# EAGLE design Schematic_vcc_gnd 11-10 (EAGLE 9.6.2)
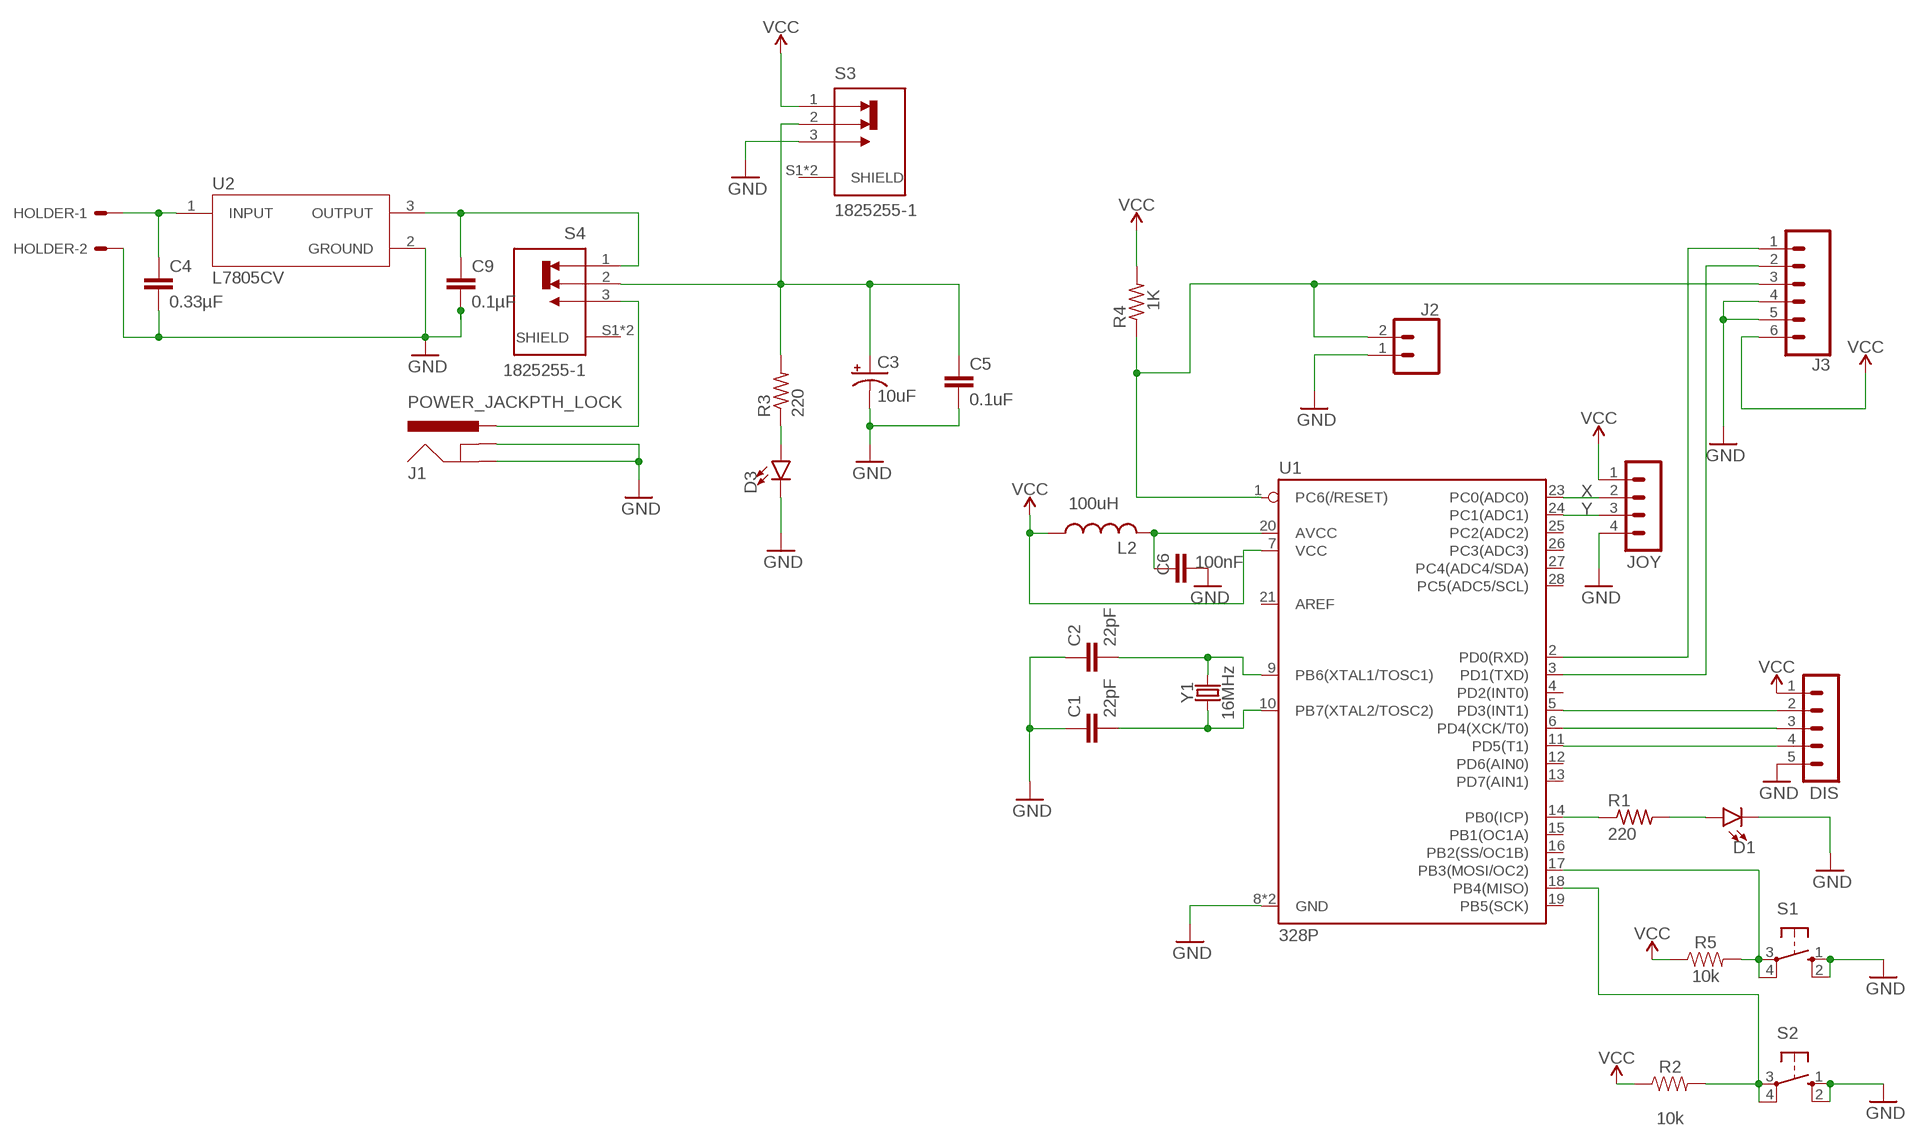
[diagram p0: schematic, sheet 1]

## Parts
C1  22pF  22PF-PTH-2.54MM-200V-5%  [CAP-PTH-2.54]
C2  22pF  22PF-PTH-2.54MM-200V-5%  [CAP-PTH-2.54]
C3  10uF  10UF-POLAR-RADIAL-2.5MM-25V-20%  [CPOL-RADIAL-2.5MM-5MM]
C4  0.33µF  C2.5/2  [C2.5-2]
C5  0.1uF  0.1UF-KIT-EZ-50V-20%  [CAP-PTH-SMALL-KIT]
C6  C2,5-3  [C2.5-3]
C9  0.1µF  C2.5/2  [C2.5-2]
D1  LED3MM  [LED_3MM]
D3  LED3MM  [LED_3MM]
DIS  MA05-1  [MA05-1]
HOLDER  22-23-2021  [22-23-2021]
J1  POWER_JACKPTH_LOCK  [POWER_JACK_PTH_LOCK]
J2  CONN_02  [1X02]
J3  CONN_06SILK_FEMALE_PTH  [1X06]
JOY  MA04-1  [MA04-1]
L2  L-US0204/5  [0204/5]
R1  220  R-US_0207/10  [0207/10]
R2  10k  10KOHM-HORIZ-1/4W-1%  [AXIAL-0.3]
R3  220  R-US_0207/10  [0207/10]
R4  1K  R-US_0207/10  [0207/10]
R5  10k  10KOHM-HORIZ-1/4W-1%  [AXIAL-0.3]
S1  40-XX  [B3F-40XX]
S2  40-XX  [B3F-40XX]
S3  1825255-1  [SW_1825255-1]
S4  1825255-1  [SW_1825255-1]
U1  328P  ATMEGA328P_PDIP  [DIP28]
U2  L7805CV  [TO255P1040X460X1968-3]
Y1  16MHz  CRYSTAL-16MHZPTH-HC49US  [HC49US]

## Nets
GND: C1.1 C2.1 C3.2(-) C4.2 C5.2 C6.2 C9.2 D1.K(C) D3.K(C) DIS.5 HOLDER.2 J1.GND J1.GNDBREAK J2.1 J3.4 J3.5 JOY.4 S1.1(S) S1.2(S1) S2.1(S) S2.2(S1) S3.3 U1.8(GND) U1.22(GND) U2.2(GROUND)
N$1: J2.2 J3.3 R4.1 U1.1(PC6(/RESET))
N$2: D3.A R3.1
N$3: C2.2 U1.9(PB6(XTAL1/TOSC1)) Y1.2
N$4: C1.2 U1.10(PB7(XTAL2/TOSC2)) Y1.1
N$5: R1.1 U1.14(PB0(ICP))
N$6: D1.A R1.2
N$7: DIS.2 U1.5(PD3(INT1))
N$8: DIS.3 U1.6(PD4(XCK/T0))
N$9: J3.1 U1.2(PD0(RXD))
N$10: J3.2 U1.3(PD1(TXD))
N$11: C6.1 L2.2 U1.20(AVCC)
N$12: DIS.4 U1.11(PD5(T1))
N$13: R2.P$2 S2.3(P) S2.4(P1) U1.18(PB4(MISO))
N$14: R5.P$2 S1.3(P) S1.4(P1) U1.17(PB3(MOSI/OC2))
N$15: J1.PWR S4.3
N$16: C4.1 HOLDER.1 U2.1(INPUT)
N$17: C9.1 S4.1 U2.3(OUTPUT)
N$19: C3.1(+) C5.1 R3.2 S3.2 S4.2
VCC: DIS.1 J3.6 JOY.1 L2.1 R2.P$1 R4.2 R5.P$1 S3.1 U1.7(VCC)
X: JOY.2 U1.23(PC0(ADC0))
Y: JOY.3 U1.24(PC1(ADC1))
Unconnected: S3.S1(SHIELD) S3.S2(SHIELD) S4.S1(SHIELD) S4.S2(SHIELD) U1.4(PD2(INT0)) U1.12(PD6(AIN0)) U1.13(PD7(AIN1)) U1.15(PB1(OC1A)) U1.16(PB2(SS/OC1B)) U1.19(PB5(SCK)) U1.21(AREF) U1.25(PC2(ADC2)) U1.26(PC3(ADC3)) U1.27(PC4(ADC4/SDA)) U1.28(PC5(ADC5/SCL))

## Library data of the parts
C1 C2 = SparkFun-Capacitors:22PF: 22pF ceramic capacitors A capacitor is a passive two-terminal electrical component used to store electrical energy temporarily in an electric field.; PROD_ID: CAP-09128
C3 = SparkFun-Capacitors:10UF-POLAR: 10.0µF polarized capacitors A capacitor is a passive two-terminal electrical component used to store electrical energy temporarily in an electric field.; PROD_ID: CAP-08440
C4 C6 C9 = capacitor-wima:C: CAPACITOR naming: grid - package width
C5 = SparkFun-Capacitors:0.1UF: 0.1µF ceramic capacitors A capacitor is a passive two-terminal electrical component used to store electrical energy temporarily in an electric field.; PROD_ID: CAP-08370
D1 D3 = SparkFun-LED:LED: LED (Generic) Standard schematic elements and footprints for 5mm, 3mm, 1206, and 0603 sized LEDs. Generic LEDs with no color specified.; PROD_ID: DIO-08794
DIS = con-lstb:MA05-1: PIN HEADER; OC_FARNELL: unknown; OC_NEWARK: unknown
HOLDER = con-molex:22-23-2021: .100" (2.54mm) Center Header - 2 Pin; MF: MOLEX; MPN: Holder; OC_FARNELL: 1462926; OC_NEWARK: 25C3832
J1 = SparkFun-Connectors:POWER_JACK: Power Jack Connector This is the standard 5.5mm barrel jack for power. The PTH is the most common, proven, reliable, footprint. The Slot footprint only works if the mill layer is transmitted to the PCB fab house so be warned. Here are the connectors we sell at SparkFun: DC Barrel Power Jack/Connector <https://www.sparkfun.com/products/119> (PRT-00119) DC Barrel Power Jack/Connector (SMD) <https://www.sparkfun.com/products/12748> (PRT-12748) DC Barrel Jack Adapter - Breadboard Compatible <https://www.sparkfun.com/products/10811> (PRT-10811) It is used on this SparkFun product (and many, many others): SparkFun RedBoard - Programmed with Arduino <https://www.sparkfun.com/products/12757> (DEV-12757) Also, if you need a mating power supply or connector, please check these out: Wall Adapter Power Supply - 9VDC 650mA <https://www.sparkfun.com/products/298> (TOL-00298) DC Barrel Jack Adapter - Male <https://www.sparkfun.com/products/10287> (PRT-10287); PROD_ID: CONN-08197; SF_ID: PRT-00119
J2 = SparkFun-Connectors:CONN_02: Multi connection point. Often used as Generic Header-pin footprint for 0.1 inch spaced/style header connections On any of the 0.1 inch spaced packages, you can populate with these: Break Away Headers - Straight <https://www.sparkfun.com/products/116> (PRT-00116) Break Away Male Headers - Right Angle <https://www.sparkfun.com/products/553> (PRT-00553) Female Headers <https://www.sparkfun.com/products/115> (PRT-00115) Break Away Headers - Machine Pin <https://www.sparkfun.com/products/117> (PRT-00117) Break Away Female Headers - Swiss Machine Pin <https://www.sparkfun.com/products/743> (PRT-00743) For SCREWTERMINALS and SPRING TERMINALS visit here: Screw Terimnals on SparkFun.com <https://www.sparkfun.com/search/results?term=Screw+Terminals> (5mm/3.5mm/2.54mm spacing) This device is also useful as a general connection point to wire up your design to another part of your project. Our various solder wires solder well into these plated through hole pads. Hook-Up Wire - Assortment (Stranded, 22 AWG) <https://www.sparkfun.com/products/11375> (PRT-11375) Hook-Up Wire - Assortment (Solid Core, 22 AWG) <https://www.sparkfun.com/products/11367> (PRT-11367) View the entire wire category on our website here <https://www.sparkfun.com/categories/141> Special notes: Molex polarized connector foot print use with: PRT-08233 with associated crimp pins and housings. 2.54_SCREWTERM for use with PRT-10571. 3.5mm Screw Terminal footprints for PRT-08084 5mm Screw Terminal footprints for use with PRT-08432
J3 = SparkFun-Connectors:CONN_06: Multi connection point. Often used as Generic Header-pin footprint for 0.1 inch spaced/style header connections On any of the 0.1 inch spaced packages, you can populate with these: Break Away Headers - Straight <https://www.sparkfun.com/products/116> (PRT-00116) Break Away Male Headers - Right Angle <https://www.sparkfun.com/products/553> (PRT-00553) Female Headers <https://www.sparkfun.com/products/115> (PRT-00115) Break Away Headers - Machine Pin <https://www.sparkfun.com/products/117> (PRT-00117) Break Away Female Headers - Swiss Machine Pin <https://www.sparkfun.com/products/743> (PRT-00743) Arduino Stackable Header - 6 Pin <https://www.sparkfun.com/products/9280> (PRT-09280) For SCREWTERMINALS and SPRING TERMINALS visit here: Screw Terimnals on SparkFun.com <https://www.sparkfun.com/search/results?term=Screw+Terminals> (5mm/3.5mm/2.54mm spacing) This device is also useful as a general connection point to wire up your design to another part of your project. Our various solder wires solder well into these plated through hole pads. Hook-Up Wire - Assortment (Stranded, 22 AWG) <https://www.sparkfun.com/products/11375> (PRT-11375) Hook-Up Wire - Assortment (Solid Core, 22 AWG) <https://www.sparkfun.com/products/11367> (PRT-11367) View the entire wire category on our website here <https://www.sparkfun.com/categories/141>; PROD_ID: CONN-08437
JOY = con-lstb:MA04-1: PIN HEADER; OC_FARNELL: unknown; OC_NEWARK: unknown
L2 = rcl:L-US: INDUCTOR, American symbol; SPICEPREFIX: L
R1 R3 R4 = rcl:R-US_: RESISTOR, American symbol; SPICEPREFIX: R
R2 R5 = SparkFun-Resistors:10KOHM: 10kΩ resistor A resistor is a passive two-terminal electrical component that implements electrical resistance as a circuit element. Resistors act to reduce current flow, and, at the same time, act to lower voltage levels within circuits. - Wikipedia; PROD_ID: RES-12183
S1 S2 = switch-omron:40-XX: OMRON SWITCH; MF: OMRON COMPONENTS USA; MPN: B3F-4000; OC_FARNELL: 176434; OC_NEWARK: 36K3105
S3 S4 = 1825255-1:1825255-1: Switch Slide ON None ON SPDT Top Slide 0.3A 125VAC PC Pins Thru-Hole Tray; MANUFACTURER: TE Connectivity; MAXIMUM_PACKAGE_HEIGHT: 12 mm; PARTREV: B2; STANDARD: Manufacturer Recommendations
U1 = SparkFun-IC-Microcontroller:ATMEGA328P_PDIP: Atmel 328P Through hole ATMEGA328P uC used in the Arduino 32kb flash, 1k EEPROM, 2k SRAM Datasheet <http://www.sparkfun.com/datasheets/Components/SMD/ATMega328.pdf> SparkFun Products Storefront component: AVR 28 Pin 20MHz 32K 6A/D - ATMega328P <https://www.sparkfun.com/products/9061> (COM-09061) SparkFun Simon Says - Through-Hole Soldering Kit <https://www.sparkfun.com/products/10547> (KIT-10547) SparkFun Learn to Solder - Simon Says <https://www.sparkfun.com/products/13708> (KIT-13708) SparkFun BigTime Watch Kit <https://www.sparkfun.com/products/11734> (KIT-11734) SparkFun ClockIt <https://www.sparkfun.com/products/10930> (KIT-10930) SparkFun Serial Enabled LCD Kit <https://www.sparkfun.com/products/10097> (LCD-10097) SparkFun Simon Tilts - Through Hole Soldering Kit <https://www.sparkfun.com/products/12634> (KIT-12634) SparkFun Frequency Counter Kit <https://www.sparkfun.com/products/10140> (KIT-10140) FabFM Radio Kit <https://www.sparkfun.com/products/11043> (KIT-11043) SparkFun Binary Blaster Kit <https://www.sparkfun.com/products/12037> (KIT-12037) SparkFun Metro-Gnome <https://www.sparkfun.com/products/9236> (KIT-09236) ATmega328 with Arduino Optiboot (Uno) <https://www.sparkfun.com/products/10524> (DEV-10524); PROD_ID: IC-09136
U2 = L7805CV:L7805CV: Standard Regulator Pos 5V 1.5A 3-Pin(3+Tab) TO-220 Standard Regulator Pos 5V 1.5A 3-Pin(3+Tab) TO-220 Check availability <https://pricing.snapeda.com/parts/L7805CV/STMicroelectronics/view-part?ref=eda>; AVAILABILITY: In Stock; DESCRIPTION: Linear Voltage Regulator IC Positive Fixed 1 Output 1.5A TO-220; MF: STMicroelectronics; MP: L7805CV; PACKAGE: TO-220-3 ON Semiconductor; PRICE: None; PURCHASE-URL: https://pricing.snapeda.com/search/part/L7805CV/?ref=eda
Y1 = SparkFun-Clocks:CRYSTAL-16MHZ: 16MHz Crystal Digikey Example <http://www.digikey.com/product-search/en?keywords=535-9122-1-ND> Frequency: 16MHz Frequency Stability: ±50ppm Frequency Tolerance: ±20ppm Load Capacitance: 18pF SparkFun Products: Pro Micro -5V/16MHz <https://www.sparkfun.com/products/12640> SparkFun Serial Enabled LCD Kit <https://www.sparkfun.com/products/10097>; PROD_ID: XTAL-08181; SF_ID: COM-00536

## Net classes
0 default: width 0.254 mm, drill 0.508 mm, clearance 0.254 mm

## Board
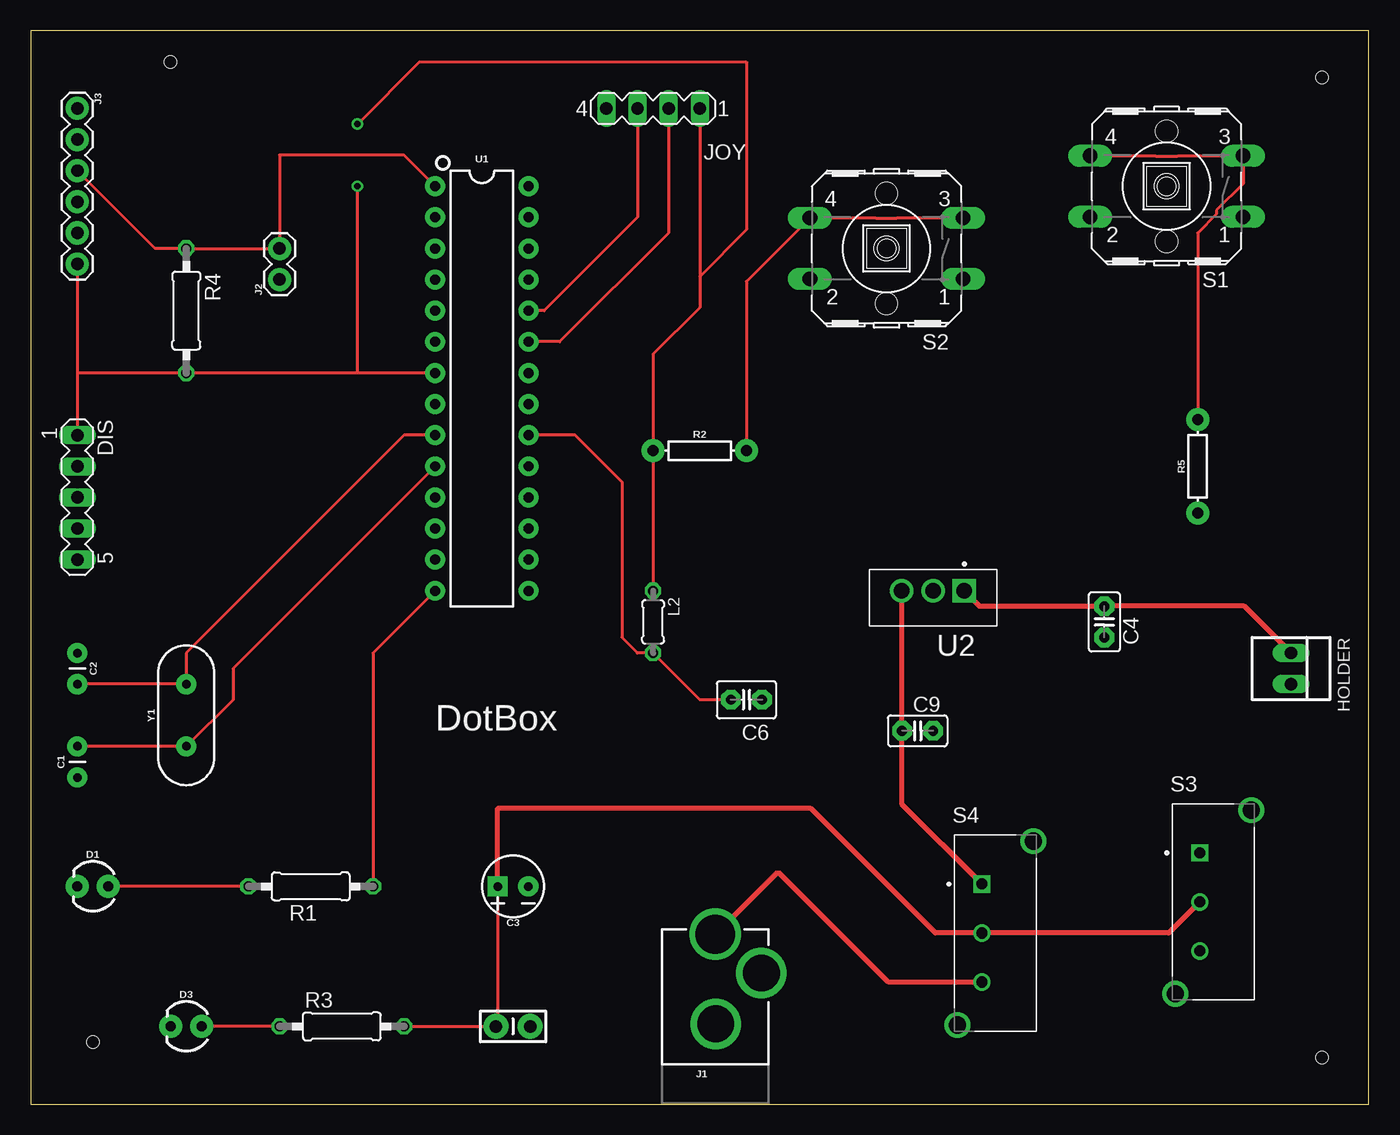
[diagram p1: board, top side]
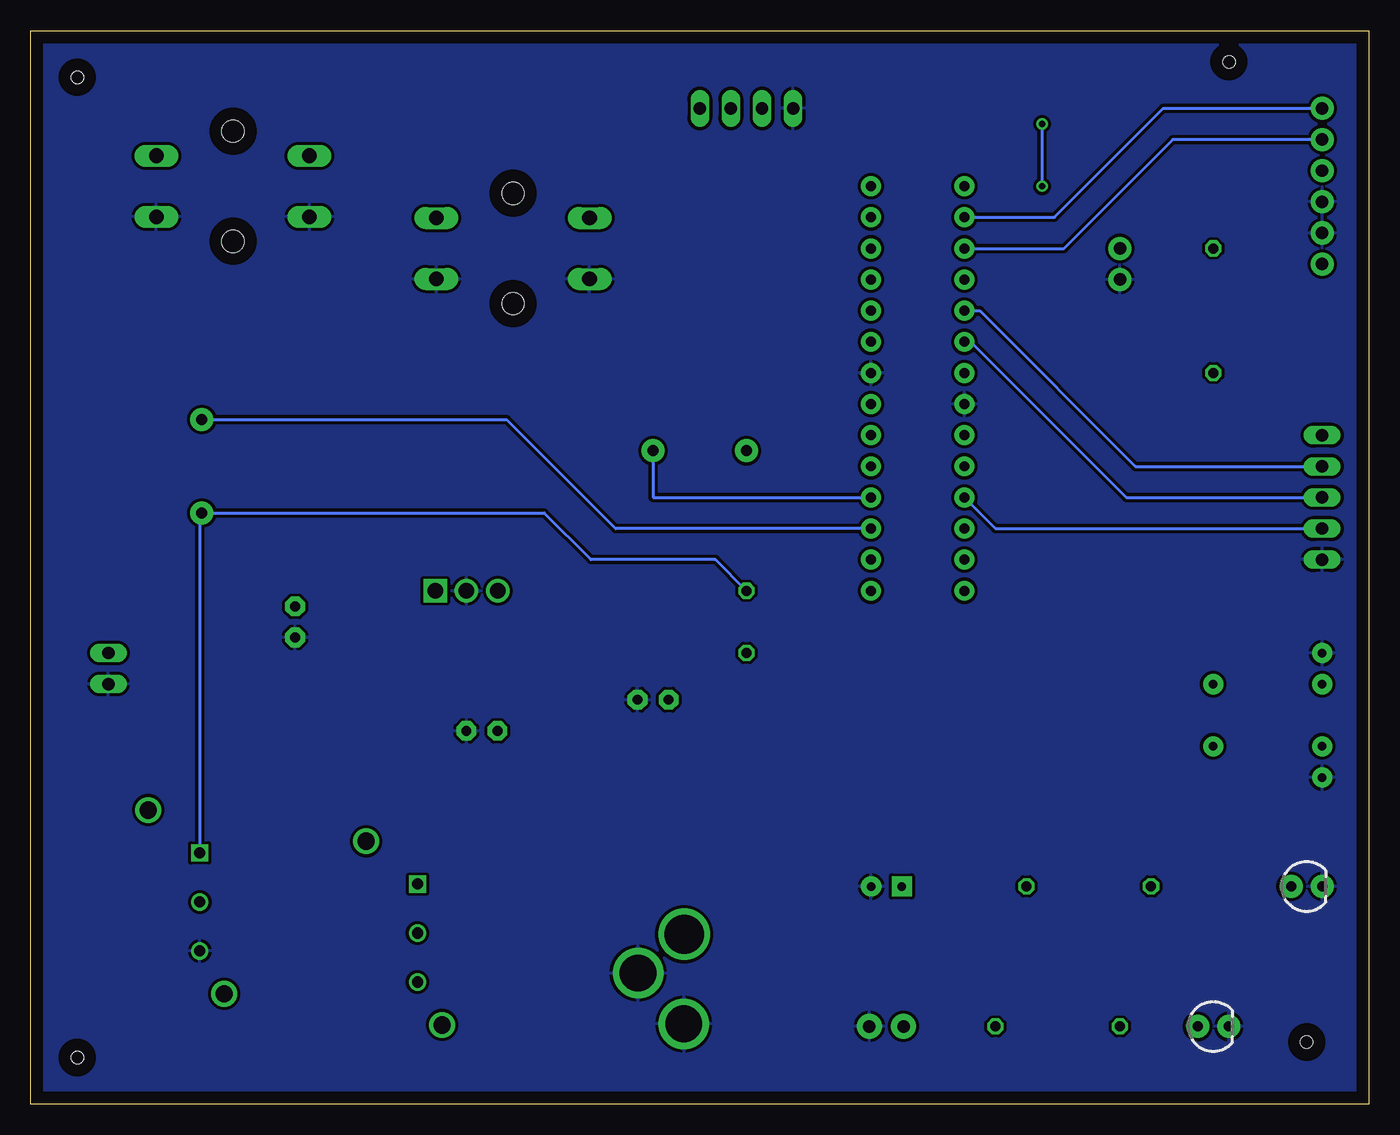
[diagram p2: board, bottom side, seen from below]

Size 109.22 x 87.63 mm. Coordinates in mm from the lower left corner, seen from the top.
Outline: 0,0 109.22,0 109.22,87.63 0,87.62 0,0
Copper layers (1*16): Top 0.035mm / dielectric 1.5mm / Bottom 0.035mm
Design rules "default": minimum track width 6mil, minimum drill 0.35mm, track to track 6mil, track to pad 6mil, pad to pad 6mil, via to via 6mil, smd to smd 6mil, copper to edge 40mil, drill to drill 6mil, minimum pad ring 10mil, minimum via ring 8mil, stop-mask expansion 4mil, vias tented up to drill 0mil, thermal gap 10mil
Holes 1 mm at 11.43,85.09 5.08,5.08 105.41,3.81 105.41,83.82

### Footprints (pad centres in the part's own frame; a part is rotated, then mirrored left to right if it is on the bottom)
CAP-PTH-2.54 = drill 0.7 pad 1.651: 1 -1.27,0; 2 1.27,0
CPOL-RADIAL-2.5MM-5MM = drill 0.7 pad 1.651 square: 1 1.25,0 | drill 0.7 pad 1.651: 2 -1.25,0
C2.5-2 = drill 0.813 pad 1.6 octagon: 1 -1.27,0; 2 1.27,0
CAP-PTH-SMALL-KIT = drill 1.016 pad 2.032: 1 -1.397,0; 2 1.397,0
C2.5-3 = drill 0.813 pad 1.6 octagon: 1 -1.27,0; 2 1.27,0
LED_3MM = drill 0.813 pad 1.88: A -1.27,0; K 1.27,0
MA05-1 = drill 1.016 long: 1 -5.08,0; 2 -2.54,0; 3 0,0; 4 2.54,0; 5 5.08,0
22-23-2021 = drill 1 long: 1 -1.27,0; 2 1.27,0
POWER_JACK_PTH_LOCK = drill 2.997 pad 4.115: GND 0.025,6.557; GNDBREAK 3.762,10.7 | drill 3.2 pad 4.115: PWR 0,13.878
1X02 = drill 1.016 pad 1.88: 1 0,0; 2 2.54,0
1X06 = drill 1.016 pad 1.88: 1 0,0; 2 2.54,0; 3 5.08,0; 4 7.62,0; 5 10.16,0; 6 12.7,0
MA04-1 = drill 1.016 long: 1 -3.81,0; 2 -1.27,0; 3 1.27,0; 4 3.81,0
0204/5 = drill 0.813 octagon: 1 -2.54,0; 2 2.54,0
0207/10 = drill 0.813 octagon: 1 -5.08,0; 2 5.08,0
AXIAL-0.3 = drill 0.9 pad 1.88: P$1 -3.81,0; P$2 3.81,0
B3F-40XX = drill 1.194 long: 1 -6.248,2.489; 2 6.248,2.489; 3 -6.248,-2.489; 4 6.248,-2.489 | hole 1.803: 0,-4.496; 0,4.496
SW_1825255-1 = drill 0.902 square: 1 -1.1,4 | drill 0.902: 2 -1.1,0; 3 -1.1,-4 | drill 1.402: S1 3.1,7.5; S2 -3.1,-7.5
DIP28 = drill 0.813 pad 1.626: 1 -16.51,-3.81; 2 -13.97,-3.81; 3 -11.43,-3.81; 4 -8.89,-3.81; 5 -6.35,-3.81; 6 -3.81,-3.81; 7 -1.27,-3.81; 8 1.27,-3.81; 9 3.81,-3.81; 10 6.35,-3.81; 11 8.89,-3.81; 12 11.43,-3.81; 13 13.97,-3.81; 14 16.51,-3.81; 15 16.51,3.81; 16 13.97,3.81; 17 11.43,3.81; 18 8.89,3.81; 19 6.35,3.81; 20 3.81,3.81; 21 1.27,3.81; 22 -1.27,3.81; 23 -3.81,3.81; 24 -6.35,3.81; 25 -8.89,3.81; 26 -11.43,3.81; 27 -13.97,3.81; 28 -16.51,3.81
TO255P1040X460X1968-3 = drill 1.27 pad 1.91 square: 1 0,0 | drill 1.27 pad 1.91: 2 2.55,0; 3 5.1,0
HC49US = drill 0.7 pad 1.651: 1 -2.54,0; 2 2.54,0

### Placement (x,y rotation side)
C1  3.81,27.94 90 top
C2  3.81,35.56 270 top
C3  39.37,17.78 180 top
C4  87.63,39.37 270 top
C5  39.37,6.35 0 top
C6  58.42,33.02 0 top
C9  72.39,30.48 0 top
D1  5.08,17.78 0 bottom
D3  12.7,6.35 0 bottom
DIS  3.81,49.53 270 top
HOLDER  102.87,35.56 270 top
J1  55.88,0 0 top
J2  20.32,67.31 90 top
J3  3.81,81.28 270 top
JOY  50.8,81.28 180 top
L2  50.8,39.37 270 top
R1  22.86,17.78 180 top
R2  54.61,53.34 0 top
R3  25.4,6.35 0 top
R4  12.7,64.77 270 top
R5  95.25,52.07 90 top
S1  92.71,74.93 180 top
S2  69.85,69.85 180 top
S3  96.52,16.51 0 top
S4  78.74,13.97 0 top
U1  36.83,58.42 270 top
U2  76.2,41.91 180 top
Y1  12.7,31.75 90 top

### Tracks (layer width: path | path; a pad name or v marks a point on that pad's centre or on a via)
GND
  pour Bottom: 0,87.63 0,0 109.22,0 109.22,87.63
N$1
  Top 0.254: U1.1 30.48,77.47 20.32,77.47 J2.2 R4.1 10.16,69.85 J3.3
N$2
  Top 0.254: R3.1 D3.A
N$3
  Top 0.254: U1.9 30.48,54.61 12.7,36.83 Y1.2 C2.2
N$4
  Top 0.254: U1.10 16.51,35.56 16.51,33.02 Y1.1 C1.2
N$5
  Top 0.254: U1.14 27.94,36.83 R1.1
N$6
  Top 0.254: R1.2 D1.A
N$7
  Bottom 0.254: DIS.2 19.05,52.07 31.75,64.77 U1.5
N$8
  Bottom 0.254: DIS.3 19.81,49.53 32.51,62.23 U1.6
N$9
  Bottom 0.254: U1.2 25.65,72.39 16.76,81.28 J3.1
N$10
  Bottom 0.254: U1.3 24.89,69.85 16,78.74 J3.2
N$11
  Top 0.254: C6.1 54.61,33.02 L2.2 49.53,36.83 48.26,38.1 48.26,50.8 44.45,54.61 U1.20
N$12
  Bottom 0.254: U1.11 30.48,46.99 DIS.4
N$13
  Top 0.254: S2.3 70.73,72.34 70.7,72.3 69,72.3 68.96,72.34 S2.4 58.42,67.16 R2.P$2
  Bottom 0.254: U1.18 58.42,49.53 R2.P$2
N$14
  Top 0.254: S1.4 91.83,77.42 91.86,77.38 93.56,77.38 93.59,77.42 S1.3 98.96,75.14 96.79,72.97 96.79,72.66 95.25,71.12 R5.P$2
  Bottom 0.254: U1.17 61.47,46.99 70.36,55.88 R5.P$2
N$15
  Top 0.406: J1.PWR 60.86,18.86 61.13,18.86 70.02,9.97 S4.3
N$16
  Top 0.406: U2.1 77.47,40.64 C4.1 87.64,40.65 99.05,40.65 HOLDER.1
N$17
  Top 0.406: S4.1 71.12,24.49 C9.1 71.1,30.5 U2.3
N$19
  Top 0.254: R3.2 C5.1 38.12,6.5 C3.1
  Top 0.406: S3.2 92.88,13.97 S4.2 73.83,13.97 63.67,24.13 38.12,24.13 C3.1
VCC  (via drill 0.51)
  Top 0.254: 3.81,59.69 R4.2 26.67,59.69 | J3.6 3.81,59.69 | 3.81,59.69 DIS.1 | L2.1 R2.P$1 50.8,61.21 54.61,65.02 54.61,67.56 | JOY.1 54.61,67.56 | U1.7 26.67,59.69 | v26.67,80.01 31.75,85.09 58.42,85.09 58.42,71.37 54.61,67.56 | 26.67,59.69 v26.67,74.93
  Bottom 0.254: v26.67,80.01 v26.67,74.93 | L2.1 53.34,44.45 63.5,44.45 67.31,48.26 R5.P$1 95.42,48.09 S3.1
X
  Top 0.254: JOY.2 52.07,71.12 43.18,62.23 U1.23
Y
  Top 0.254: JOY.3 49.53,72.39 41.91,64.77 U1.24

### Text on the board
tPlace: DotBox